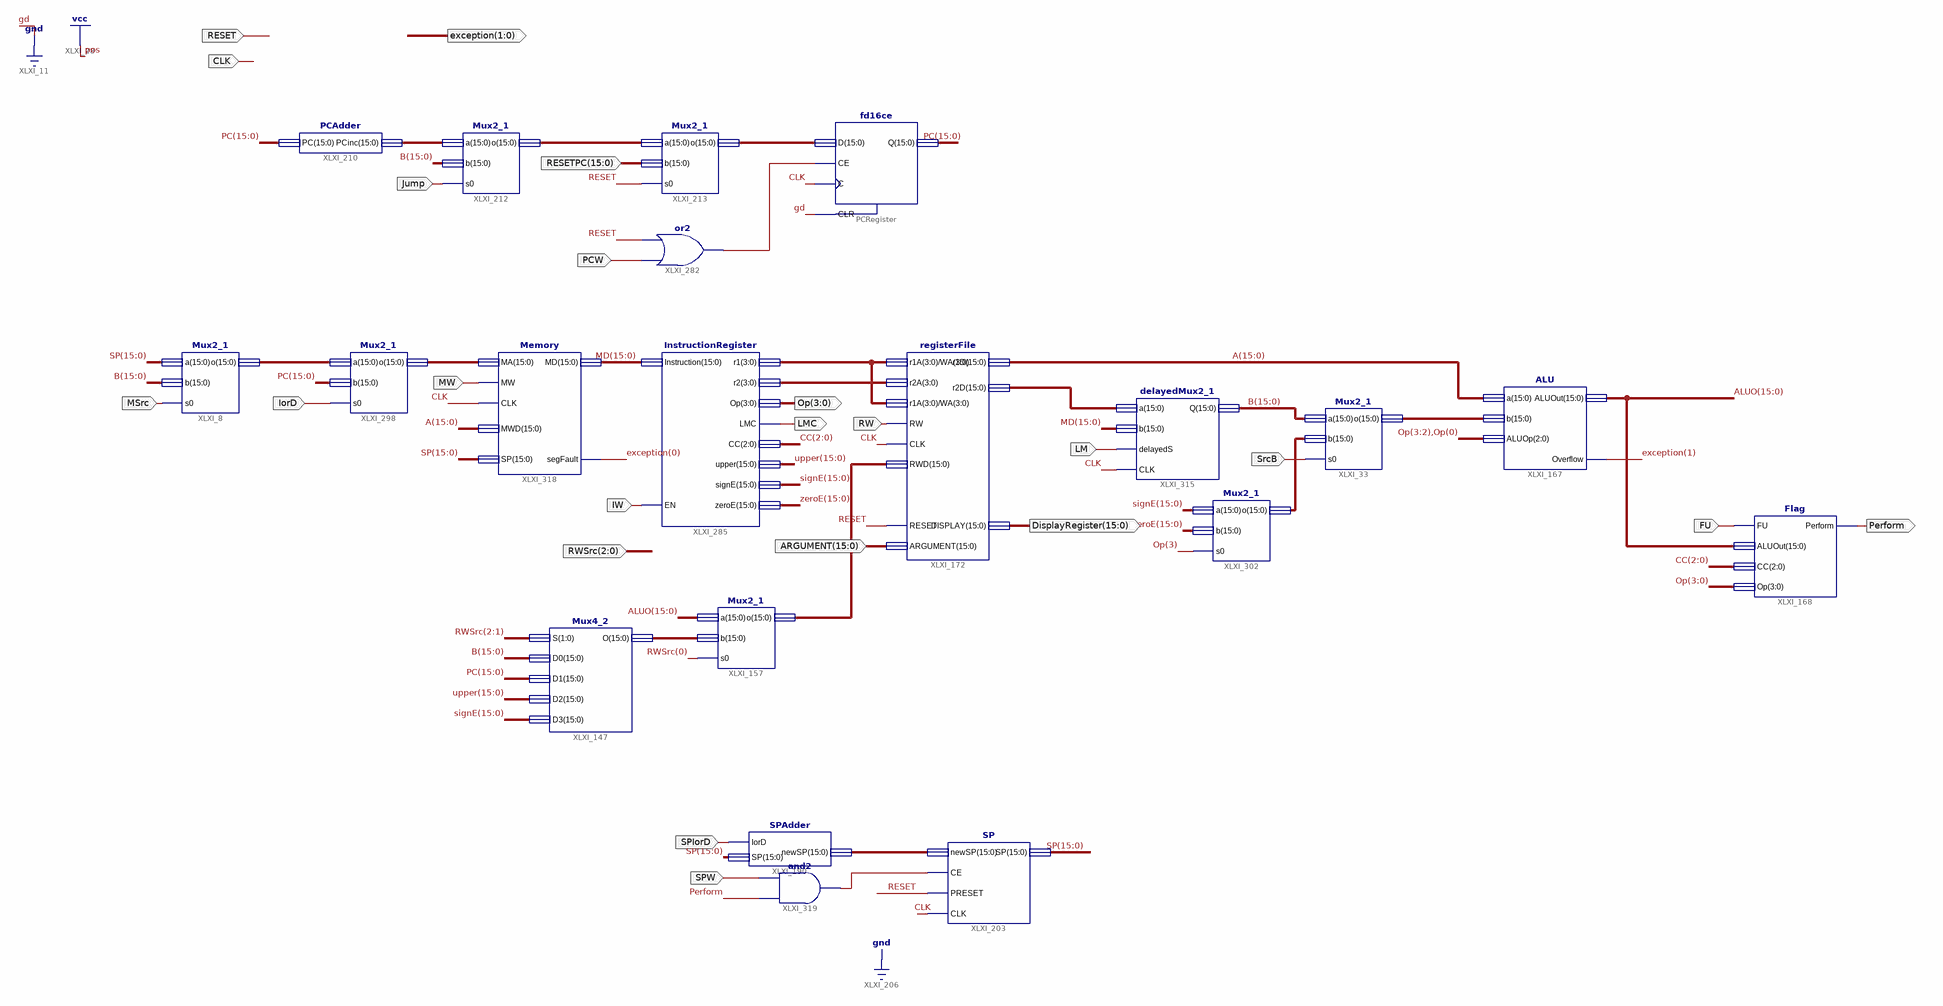
[diagram p0: schematic sheet 1]
// Xilinx ISE schematic Datapath.sch (spartan3e) as structural Verilog: 20 symbols, 22 ports
module Datapath (
  input  CLK,
  input  RW,
  input  MW,
  input  PCW,
  input  SPIorD,
  input  RESET,
  input  Jump,
  input  [15:0] RESETPC,
  input  IW,
  input  FU,
  input  IorD,
  input  MSrc,
  input  [2:0] RWSrc,
  input  SrcB,
  input  LM,
  input  [15:0] ARGUMENT,
  input  SPW,
  output [3:0] Op,
  output LMC,
  output Perform,
  output [15:0] DisplayRegister,
  output [1:0] exception
);

  wire XLXN_792, XLXN_920;
  wire [2:0] CC;
  wire [3:0] XLXN_68, XLXN_69;
  wire [15:0] A, afe, ALUO, B, MD, PC, signE, SP, upper, XLXN_43, XLXN_175, XLXN_605, XLXN_642, XLXN_667,
       XLXN_781, XLXN_864, XLXN_885, XLXN_909, XLXN_913, zeroE;

  fd16ce PCRegister (
    .C(CLK), .CE(XLXN_792), .CLR(1'b0),
    .D({XLXN_175[0], XLXN_175[1], XLXN_175[2], XLXN_175[3], XLXN_175[4], XLXN_175[5], XLXN_175[6], XLXN_175[7], XLXN_175[8], XLXN_175[9], XLXN_175[10], XLXN_175[11], XLXN_175[12], XLXN_175[13], XLXN_175[14], XLXN_175[15]}),
    .Q(PC));
  registerFile XLXI_172 (
    .RW(RW), .CLK(CLK), .r1A(XLXN_68), .r2A(XLXN_69), .WA(XLXN_68),
    .RWD({XLXN_642[0], XLXN_642[1], XLXN_642[2], XLXN_642[3], XLXN_642[4], XLXN_642[5], XLXN_642[6], XLXN_642[7], XLXN_642[8], XLXN_642[9], XLXN_642[10], XLXN_642[11], XLXN_642[12], XLXN_642[13], XLXN_642[14], XLXN_642[15]}),
    .ARGUMENT(ARGUMENT), .r1D(A), .r2D(XLXN_913), .DISPLAY(DisplayRegister), .RESET(RESET));
  SPAdder XLXI_190 (.IorD(SPIorD), .SP(SP), .newSP(XLXN_43));
  PCAdder XLXI_210 (.PC(PC), .PCinc(XLXN_667));
  Mux2_1 XLXI_212 (.a(XLXN_667), .b(B), .s0(Jump), .o(XLXN_781));
  Mux2_1 XLXI_213 (
    .a(XLXN_781), .b(RESETPC), .s0(RESET),
    .o({XLXN_175[0], XLXN_175[1], XLXN_175[2], XLXN_175[3], XLXN_175[4], XLXN_175[5], XLXN_175[6], XLXN_175[7], XLXN_175[8], XLXN_175[9], XLXN_175[10], XLXN_175[11], XLXN_175[12], XLXN_175[13], XLXN_175[14], XLXN_175[15]}));
  or XLXI_282 (XLXN_792, PCW, RESET);
  InstructionRegister XLXI_285 (
    .Instruction(MD), .LMC(LMC), .r1(XLXN_68), .r2(XLXN_69), .Op(Op), .CC(CC), .signE(signE), .upper(upper),
    .EN(IW), .zeroE(zeroE));
  ALU XLXI_167 (.a(A), .b(afe), .ALUOp({Op[3:2], Op[0]}), .ALUOut(ALUO), .Overflow(exception[1]));
  Flag XLXI_168 (.FU(FU), .ALUOut(ALUO), .CC(CC), .Op(Op), .Perform(Perform));
  Mux2_1 XLXI_298 (.a(XLXN_885), .b(PC), .s0(IorD), .o(XLXN_864));
  Mux2_1 XLXI_8 (.a(SP), .b(B), .s0(MSrc), .o(XLXN_885));
  Mux2_1 XLXI_33 (.a(B), .b(XLXN_909), .s0(SrcB), .o(afe));
  Mux2_1 XLXI_302 (.a(signE), .b(zeroE), .s0(Op[3]), .o(XLXN_909));
  delayedMux2_1 XLXI_315 (.Q(B), .delayedS(LM), .CLK(CLK), .a(XLXN_913), .b(MD));
  Mux2_1 XLXI_157 (
    .a(ALUO), .b(XLXN_605), .s0(RWSrc[0]),
    .o({XLXN_642[0], XLXN_642[1], XLXN_642[2], XLXN_642[3], XLXN_642[4], XLXN_642[5], XLXN_642[6], XLXN_642[7], XLXN_642[8], XLXN_642[9], XLXN_642[10], XLXN_642[11], XLXN_642[12], XLXN_642[13], XLXN_642[14], XLXN_642[15]}));
  Mux4_2 XLXI_147 (.S(RWSrc[2:1]), .D0(B), .D3(signE), .O(XLXN_605), .D1(PC), .D2(upper));
  Memory XLXI_318 (.MA(XLXN_864), .MW(MW), .MD(MD), .CLK(CLK), .MWD(A), .SP(SP), .segFault(exception[0]));
  SP XLXI_203 (.SP(SP), .CE(XLXN_920), .PRESET(RESET), .CLK(CLK), .newSP(XLXN_43));
  and XLXI_319 (XLXN_920, Perform, SPW);
endmodule
